# Altium schematic sheet LCD.SchDoc
size 152 x 127 mm
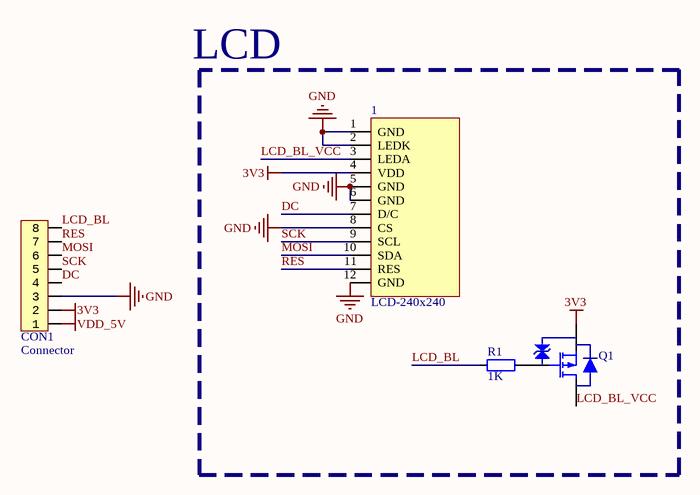
[diagram p0: LCD.SchDoc]

## Parts
1  LCD-240x240  [LCD-240x240-NoHole]
CON1  System: Connector  [FFC_0.5_8]  (hidden comment: FFC_0.5_8)
Q1  AO3415A  [SOT23-3]  (value not drawn)
R1  1K  [RES_0402]

## Nets
3V3: 1.4(VDD) CON1.2 Q1.2(S)
GND: 1.1(GND) 1.2(LEDK) 1.5(GND) 1.6(GND) 1.8(CS) 1.12(GND) CON1.3
VDD_5V: CON1.1
DC: 1.7(D/C) CON1.4
LCD_BL: CON1.8 R1.1
LCD_BL_VCC: 1.3(LEDA) Q1.3(D)
MOSI: 1.10(SDA) CON1.6
RES: 1.11(RES) CON1.7
SCK: 1.9(SCL) CON1.5
NetQ1_1: Q1.1(G) R1.2

## Notes on the sheet
- LCD

## Library data of the parts
1 = LCD-240x240: 显示屏
CON1 = FFC_0.5_8: FFC
Q1 = AO3415A: MOSFET; Published: 8-Jun-2000; LatestRevisionDate: 17-Jul-2002; LatestRevisionNote: Re-released for DXP Platform.; PackageVersion: 1995/1996; PackageReference: E3; Publisher: Altium Limited; PackageDescription: TO, Flat Index; 3 In-Line, Axial Leads; Body Dia. 4.6mm; Lead Dia. 0.5 mm (max)
R1 = 电阻-0402: Resistor; Value: 22R